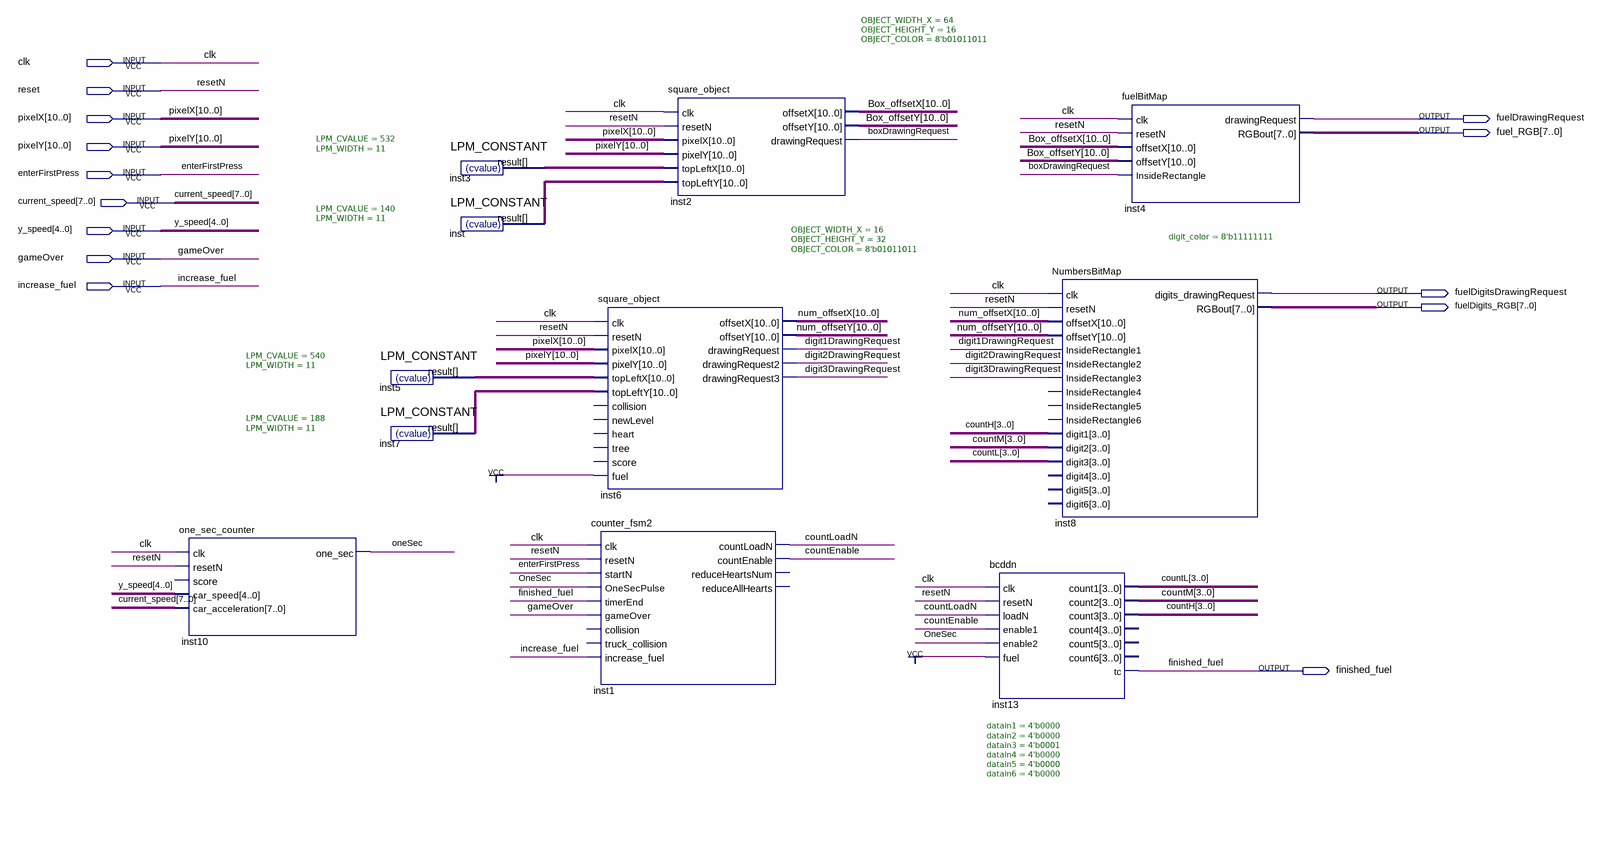
[diagram p0: schematic sheet]
// Quartus schematic fuel_Block.bdf as structural Verilog: 11 symbols, 14 pins
module fuel_Block (
  input  clk,
  input  reset,
  input  [10:0] pixelX,
  input  [10:0] pixelY,
  input  enterFirstPress,
  input  [7:0] current_speed,
  input  [4:0] y_speed,
  input  gameOver,
  input  increase_fuel,
  output fuelDrawingRequest,
  output [7:0] fuel_RGB,
  output fuelDigitsDrawingRequest,
  output [7:0] fuelDigits_RGB,
  output finished_fuel
);

  wire boxDrawingRequest, countEnable, countLoadN, digit1DrawingRequest, digit2DrawingRequest,
       digit3DrawingRequest, OneSec;
  wire [3:0] countH, countL, countM;
  wire [10:0] Box_offsetX, Box_offsetY, inst3_result, inst5_result, inst7_result, inst_result, num_offsetX,
       num_offsetY;

  one_sec_counter inst10 (
    .clk(clk), .resetN(reset), .car_speed(y_speed), .car_acceleration(current_speed), .one_sec(OneSec));  // open: score
  LPM_CONSTANT #(.LPM_CVALUE(540), .LPM_WIDTH(11)) inst5 (.result(inst5_result));
  LPM_CONSTANT #(.LPM_CVALUE(188), .LPM_WIDTH(11)) inst7 (.result(inst7_result));
  LPM_CONSTANT #(.LPM_CVALUE(532), .LPM_WIDTH(11)) inst3 (.result(inst3_result));
  LPM_CONSTANT #(.LPM_CVALUE(140), .LPM_WIDTH(11)) inst (.result(inst_result));
  square_object #(.OBJECT_WIDTH_X(16), .OBJECT_HEIGHT_Y(32), .OBJECT_COLOR(8'b01011011)) inst6 (
    .clk(clk), .resetN(reset), .pixelX(pixelX), .pixelY(pixelY), .topLeftX(inst5_result),
    .topLeftY(inst7_result), .fuel(1'b1), .offsetX(num_offsetX), .offsetY(num_offsetY),
    .drawingRequest(digit1DrawingRequest), .drawingRequest2(digit2DrawingRequest),
    .drawingRequest3(digit3DrawingRequest));  // open: collision, newLevel, heart, tree, score
  counter_fsm2 inst1 (
    .clk(clk), .resetN(reset), .startN(enterFirstPress), .OneSecPulse(OneSec), .timerEnd(finished_fuel),
    .gameOver(gameOver), .increase_fuel(increase_fuel), .countLoadN(countLoadN), .countEnable(countEnable));  // open: collision, truck_collision, reduceHeartsNum, reduceAllHearts
  square_object #(.OBJECT_WIDTH_X(64), .OBJECT_HEIGHT_Y(16), .OBJECT_COLOR(8'b01011011)) inst2 (
    .clk(clk), .resetN(reset), .pixelX(pixelX), .pixelY(pixelY), .topLeftX(inst3_result),
    .topLeftY(inst_result), .offsetX(Box_offsetX), .offsetY(Box_offsetY), .drawingRequest(boxDrawingRequest));
  bcddn #(.datain1(4'b0000), .datain2(4'b0000), .datain3(4'b0001), .datain4(4'b0000), .datain5(4'b0000), .datain6(4'b0000)) inst13 (
    .clk(clk), .resetN(reset), .loadN(countLoadN), .enable1(countEnable), .enable2(OneSec), .fuel(1'b1),
    .count1(countL), .count2(countM), .count3(countH), .tc(finished_fuel));  // open: count4, count5, count6
  NumbersBitMap #(.digit_color(8'b11111111)) inst8 (
    .clk(clk), .resetN(reset), .offsetX(num_offsetX), .offsetY(num_offsetY),
    .InsideRectangle1(digit1DrawingRequest), .InsideRectangle2(digit2DrawingRequest),
    .InsideRectangle3(digit3DrawingRequest), .digit1(countH), .digit2(countM), .digit3(countL),
    .digits_drawingRequest(fuelDigitsDrawingRequest), .RGBout(fuelDigits_RGB));  // open: InsideRectangle4, InsideRectangle5, InsideRectangle6, digit4, digit5, digit6
  fuelBitMap inst4 (
    .clk(clk), .resetN(reset), .offsetX(Box_offsetX), .offsetY(Box_offsetY),
    .InsideRectangle(boxDrawingRequest), .drawingRequest(fuelDrawingRequest), .RGBout(fuel_RGB));

  // Other names for the same wires on the sheet: resetN = reset
endmodule
